# EasyEDA schematic SCH_ESP32-Gate-Module_2024-04-16.json
TITLE: Sheet_1; REV: 1.0; Date: 2024-04-16; Sheet: 1/1; Drawn By: fcbayernmunchenerlan999; Company: Your Company
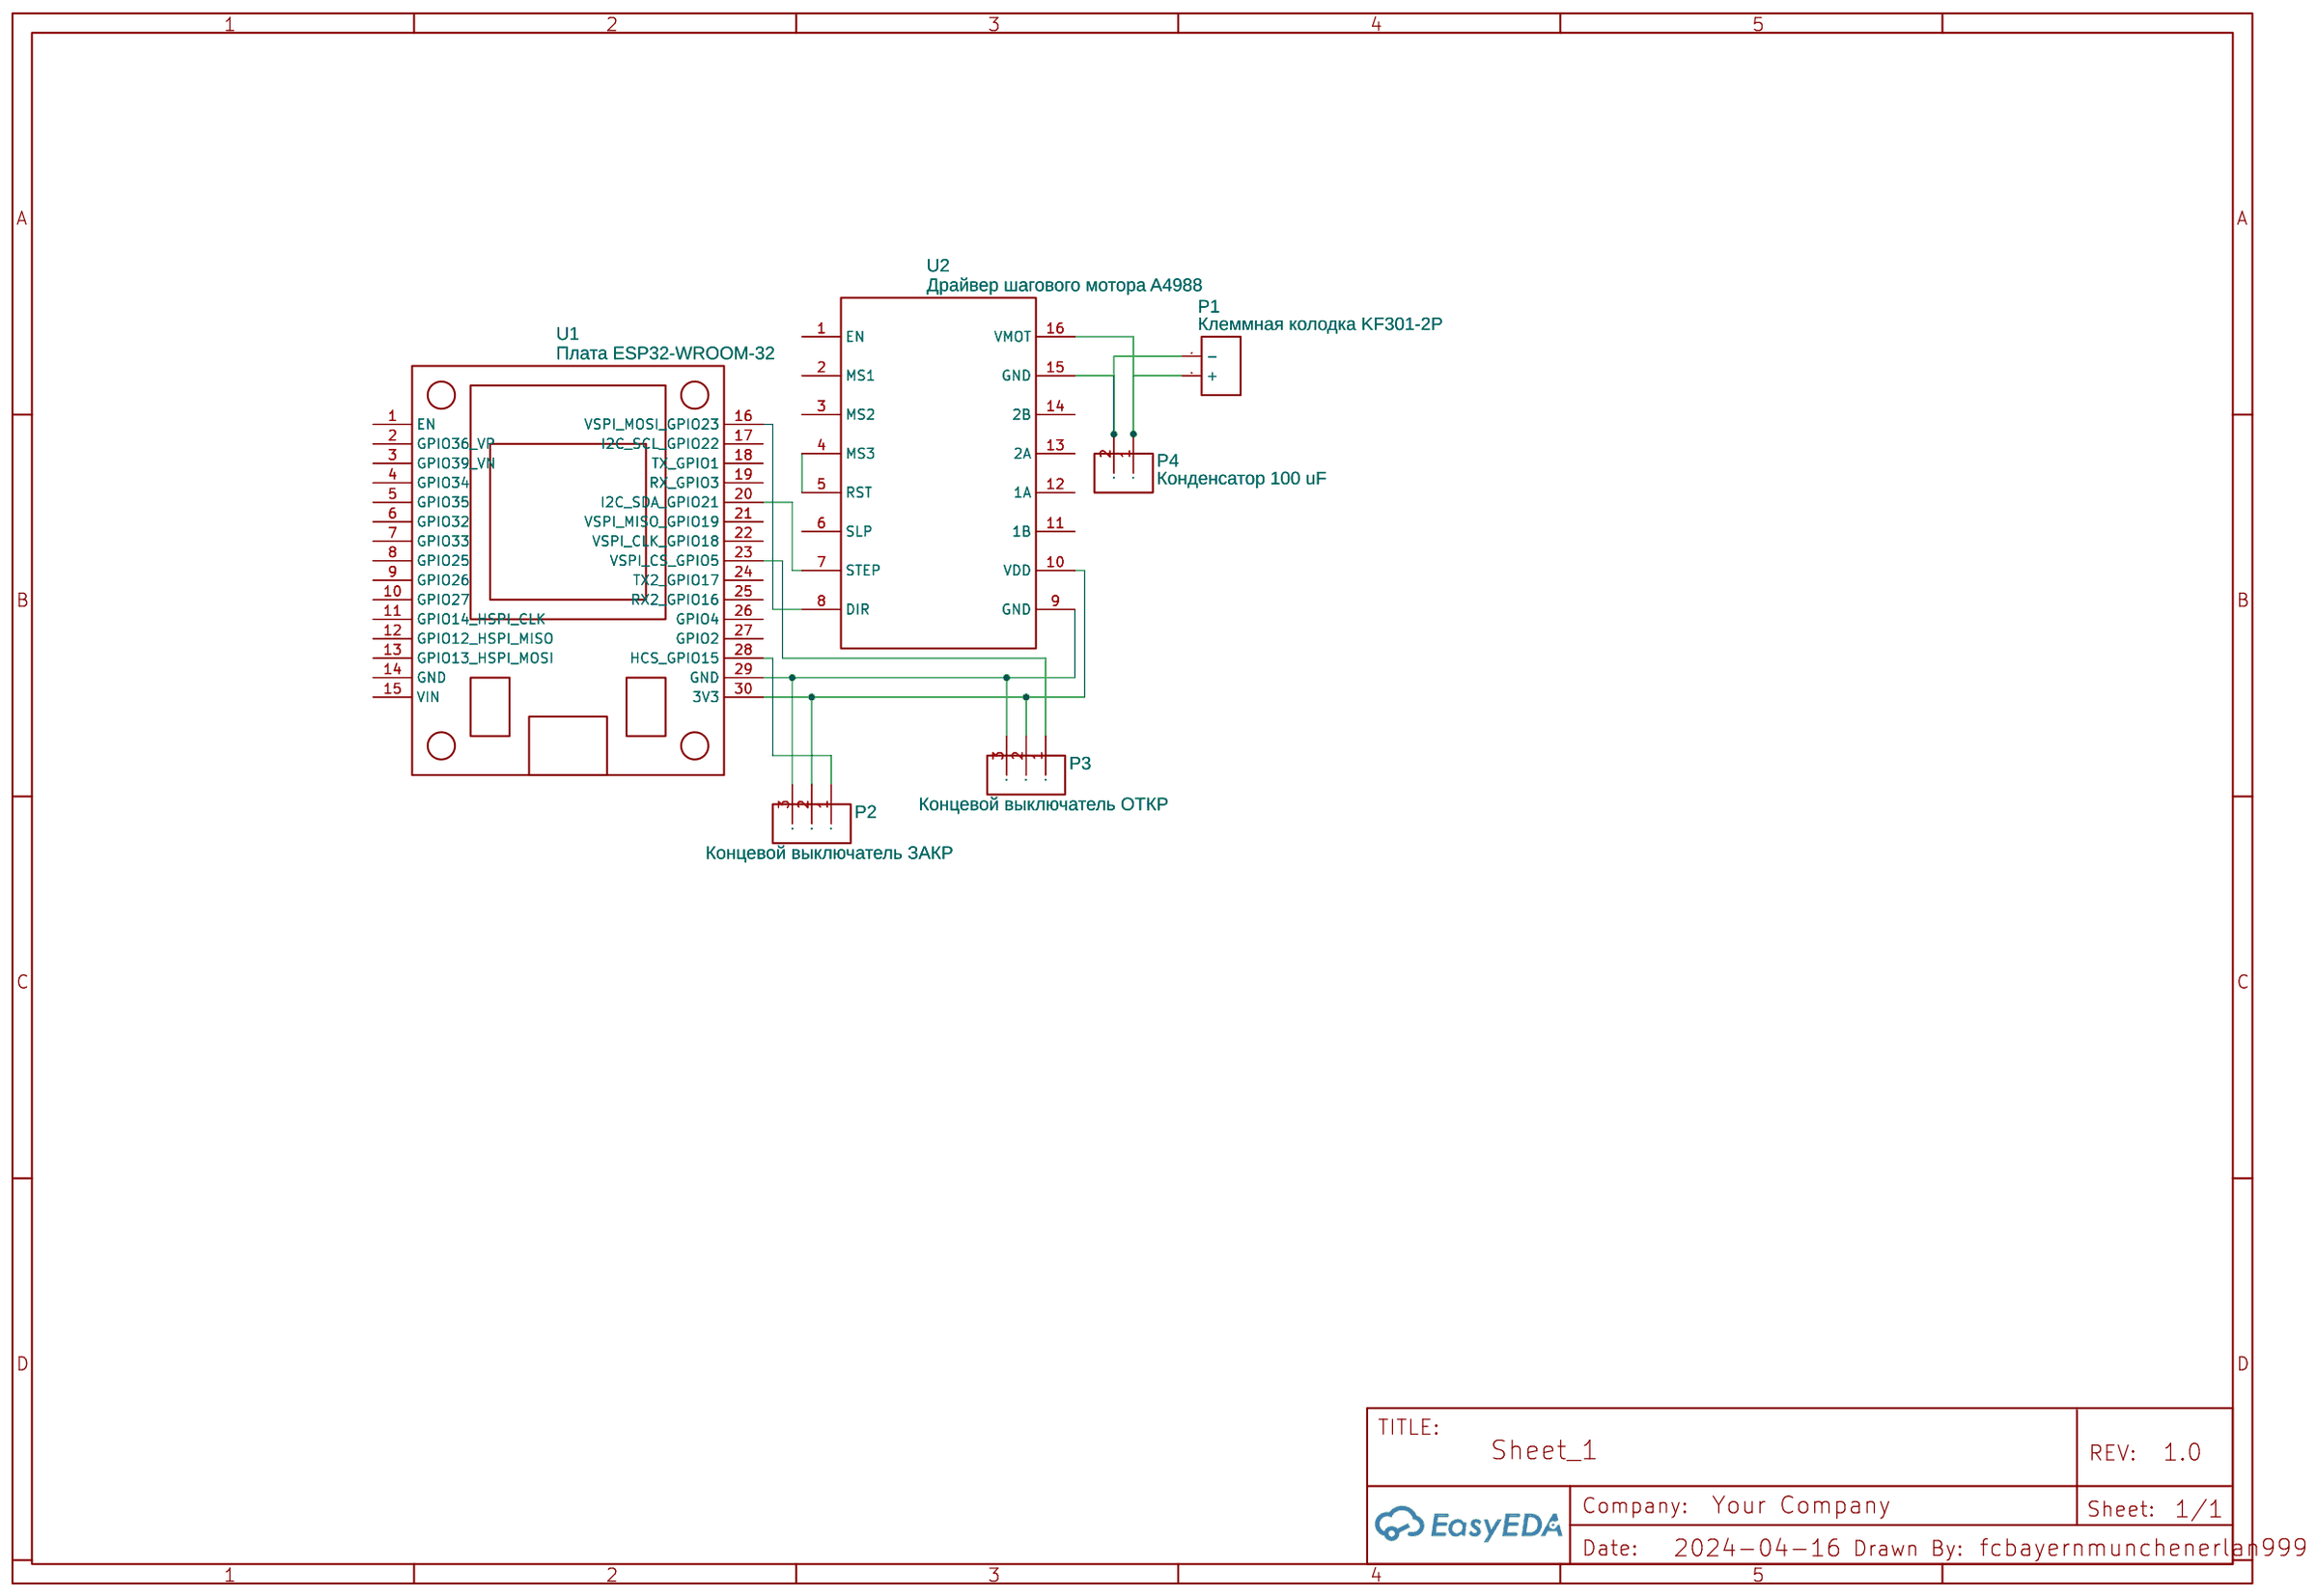
[diagram p0: schematic sheet]

## Parts
P1  Клеммная колодка KF301-2P  [CONN-TH_2P-P5.00]
P2  Концевой выключатель ЗАКР  [3X2.54 PAD]
P3  Концевой выключатель ОТКР  [3X2.54 PAD]
P4  Конденсатор 100 uF  [2X2.54 PAD]
U1  Плата ESP32-WROOM-32  [ESP32S 30PIN DEVBOARD]
U2  Драйвер шагового мотора A4988  [A4988 STEPPER MOTOR DRIVER CARRIER]

## Library data of the parts
P1 = CONN-TH_2P-P5.00: Supplier: LCSC; Contributor: LCEDA_Lib; Package Display: No
P2 P3 = 3x2.54 XHP-3 JST case: Contributor: jean boudou; Package Display: No
P4 = 2x2.54 XHP-2 JST case: Contributor: jean boudou; Package Display: No
U1 = Плата ESP32 (вариант 2): Contributor: PhilD; Package Display: No
U2 = A4988 Stepper Motor Driver Carrier: Contributor: winter2015; sourceId: YsmgyP7pj; Package Display: No

## Nets
Net-(P1-1): P1.1(-) P4.2 U2.15(GND)
Net-(P1-2): P1.2(+) P4.1 U2.16(VMOT)
Net-(P2-1): P2.1 U1.28(HCS GPIO15)
Net-(P2-2): P2.2 P3.2 U1.30(3V3) U2.10(VDD)
Net-(P2-3): P2.3 P3.3 U1.29(GND) U2.9(GND)
Net-(P3-1): P3.1 U1.23(VSPI CS GPIO5)
Net-(U1-16): U1.16(VSPI MOSI GPIO23) U2.8(DIR)
Net-(U1-20): U1.20(I2C SDA GPIO21) U2.7(STEP)
Net-(U2-4): U2.4(MS3) U2.5(RST)

Not connected (* = marked no-connect by the designer): U1 1(EN) 2(GPIO36 VP) 3(GPIO39 VN) 4(GPIO34) 5(GPIO35) 6(GPIO32) 7(GPIO33) 8(GPIO25) 9(GPIO26) 10(GPIO27) 11(GPIO14 HSPI CLK) 12(GPIO12 HSPI MISO) 13(GPIO13 HSPI MOSI) 14(GND) 15(VIN) 17(I2C SCL GPIO22) 18(TX GPIO1) 19(RX GPIO3) 21(VSPI MISO GPIO19) 22(VSPI CLK GPIO18) 24(TX2 GPIO17) 25(RX2 GPIO16) 26(GPIO4) 27(GPIO2); U2 1(EN) 2(MS1) 3(MS2) 6(SLP) 11(1B) 12(1A) 13(2A) 14(2B)
